# EAGLE design Regulator (EAGLE 7.5.0)
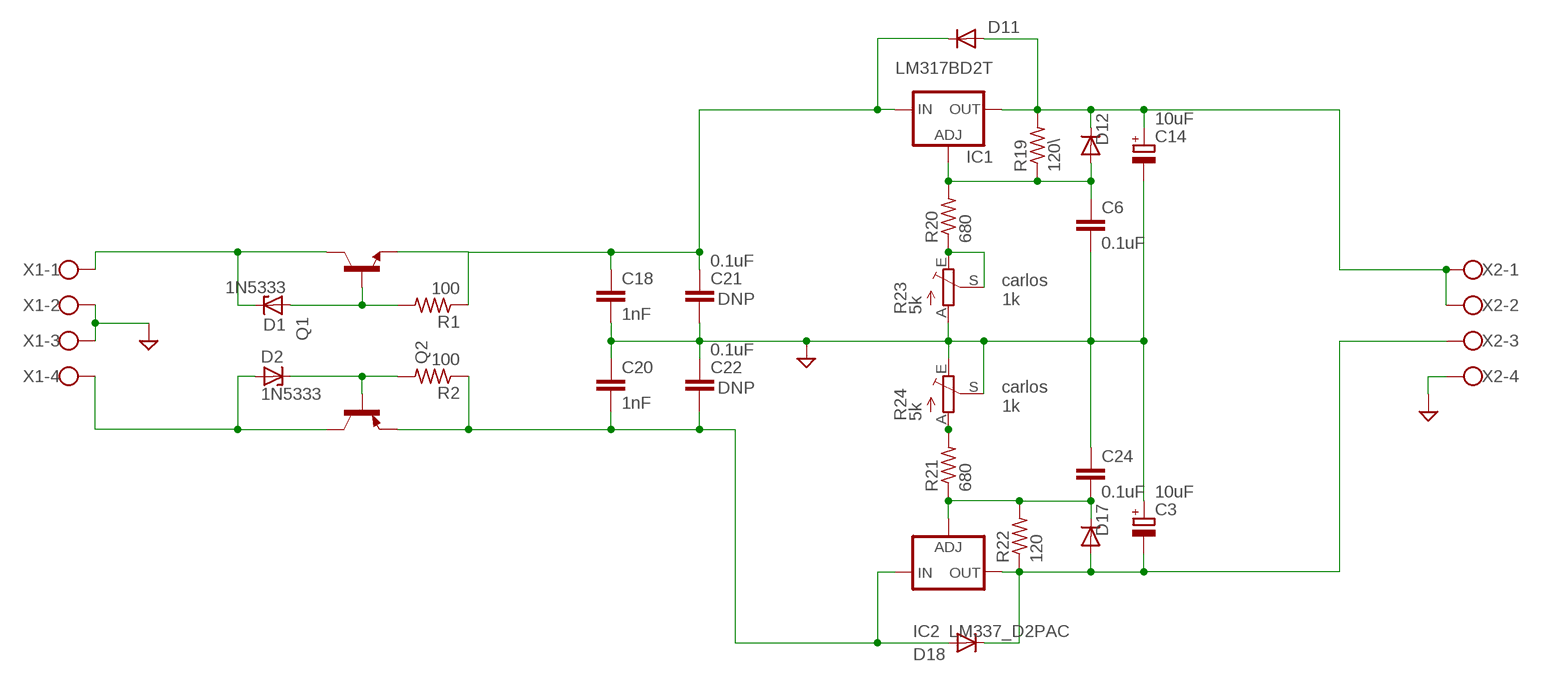
[diagram p0: schematic, sheet 1]

## Parts
C3  10uF  CPOL-EUE2.5-6  [E2,5-6]
C6  0.1uF  C-EU025-025X050  [C025-025X050]
C14  10uF  CPOL-EUE2.5-6  [E2,5-6]
C18  1nF  C-EU025-025X050  [C025-025X050]
C20  1nF  C-EU025-025X050  [C025-025X050]
C21  0.1uF  C-EU025-025X050  [C025-025X050]
C22  0.1uF  C-EU025-025X050  [C025-025X050]
C24  0.1uF  C-EU025-025X050  [C025-025X050]
D1  1N5333  [C1702-15]
D2  1N5333  [C1702-15]
D11  1N4004  [1N4004]
D12  1N4004  [1N4004]
D17  1N4004  [1N4004]
D18  1N4004  [1N4004]
IC1  LM317BD2T  [D2PACK]
IC2  LM337_D2PAC  [D2PACK]
Q1  -NPN-TO220V  [TO220V]
Q2  -PNP-TO220V  [TO220V]
R1  100  R-US_0309/12  [0309/12]
R2  100  R-US_0309/12  [0309/12]
R19  120\  R-US_0309/V  [0309V]
R20  680  R-US_0309/V  [0309V]
R21  680  R-US_0309/V  [0309V]
R22  120  R-US_0309/V  [0309V]
R23  5k  TRIM_EU-B25P  [B25P]
R24  5k  TRIM_EU-B25P  [B25P]
X1  W237-4  [W237-4]
X2  W237-4  [W237-4]

## Nets
GND: C3.+ C6.2 C14.- C18.2 C20.1 C21.2 C22.1 C24.1 R23.A R24.E R24.S X1.2 X1.3 X2.4 ; supply symbol labelled SGND
N$1: D1.A Q1.1(B) R1.2
N$3: C24.2 D17.C IC2.1(ADJ) R21.1 R22.2
N$4: D1.C Q1.2(C) X1.1
N$5: D2.C Q2.1(B) R2.2
N$6: D2.A Q2.2(C) X1.4
N$15: R20.1 R23.E R23.S
N$23: R21.2 R24.A
N$26: C6.1 D12.A IC1.1(ADJ) R19.1 R20.2
V15+: C14.+ D11.A D12.C IC1.2(OUT) R19.2 X2.1 X2.2
V15-: C3.- D17.A D18.C IC2.2(OUT) R22.1 X2.3
V15UN: C18.1 C21.1 D11.C IC1.3(IN) Q1.3(E) R1.1
V-15UN: C20.2 C22.2 D18.A IC2.3(IN) Q2.3(E) R2.1

## Notes on the sheet
- DNP
- carlos 
  1k
- DNP
- carlos 
  1k

## Library data of the parts
C3 C14 = rcl:CPOL-EU: POLARIZED CAPACITOR, European symbol
C6 C24 = resistor:C-EU: CAPACITOR, European symbol
C18 C20-C22 = rcl:C-EU: CAPACITOR, European symbol
D1 D2 = diode:1N5333: Z DIODE 3.3 V, 5W, 5 percent (Motorola)
D11 D12 D17 D18 = Amplifier_Parts:1N4004
IC1 = v-reg:LM317?*: 500 mA Adjustable Output Positive Voltage Regulator Source: http://www.onsemi.co.jp .. LM317M-D.PDF
IC2 = v-reg:LM337_D2PAC
Q1 = transistor:*-NPN-: NPN Transistror BF959 corrected 2008.03.06
Q2 = transistor:*-PNP-: PNP Transistror
R1 R2 R19-R22 = rcl:R-US_: RESISTOR, American symbol
R23 R24 = pot:TRIM_EU-: POTENTIOMETER
X1 X2 = con-wago-500:W237-4: WAGO SCREW CLAMP; OC_FARNELL: unknown; OC_NEWARK: unknown

## Board
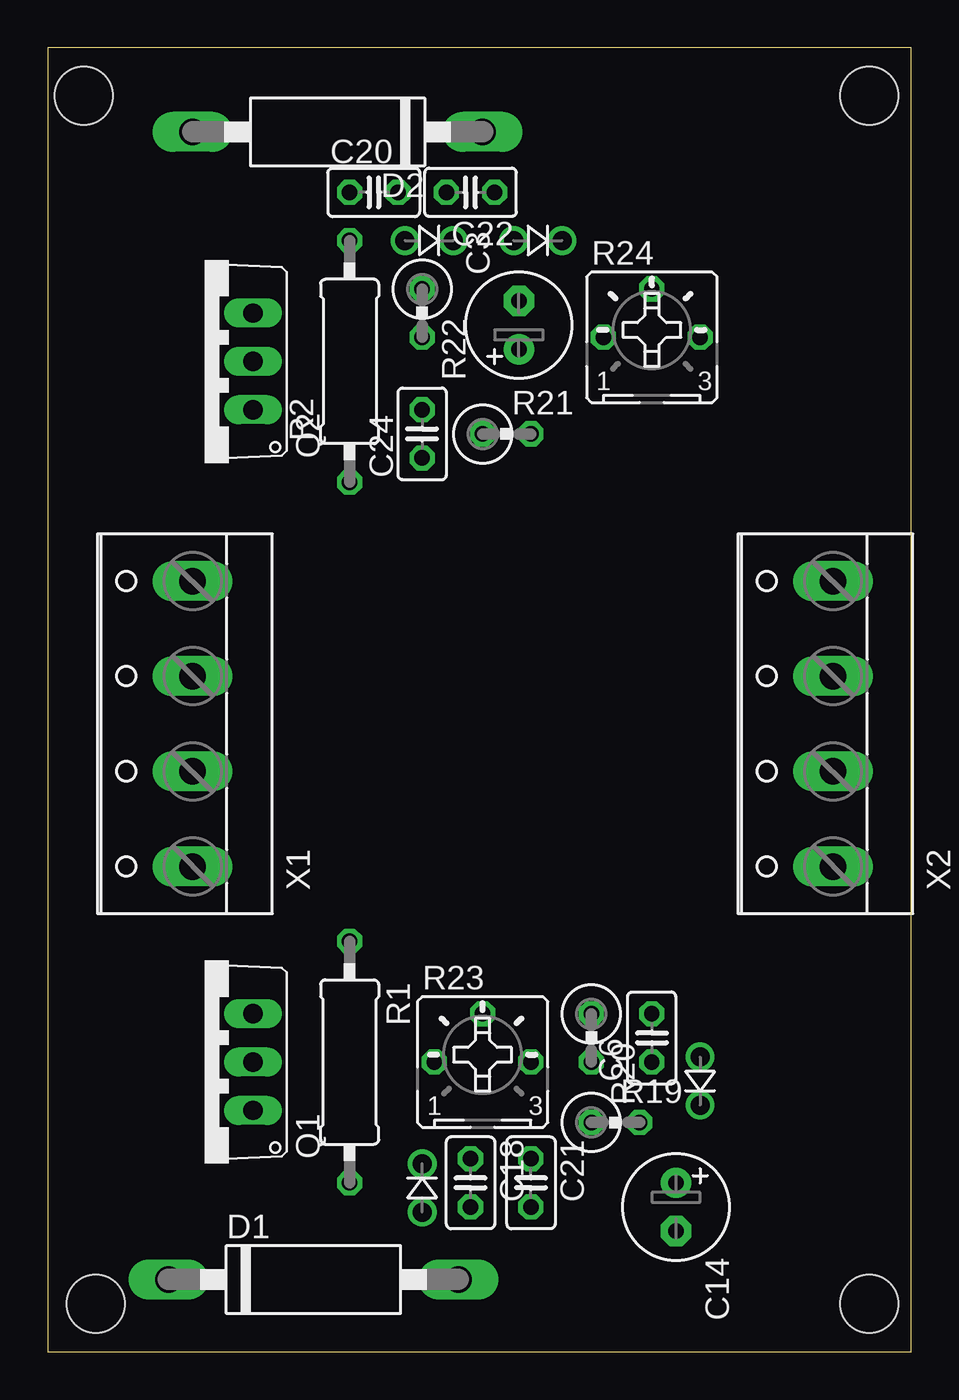
[diagram p1: board, top side]
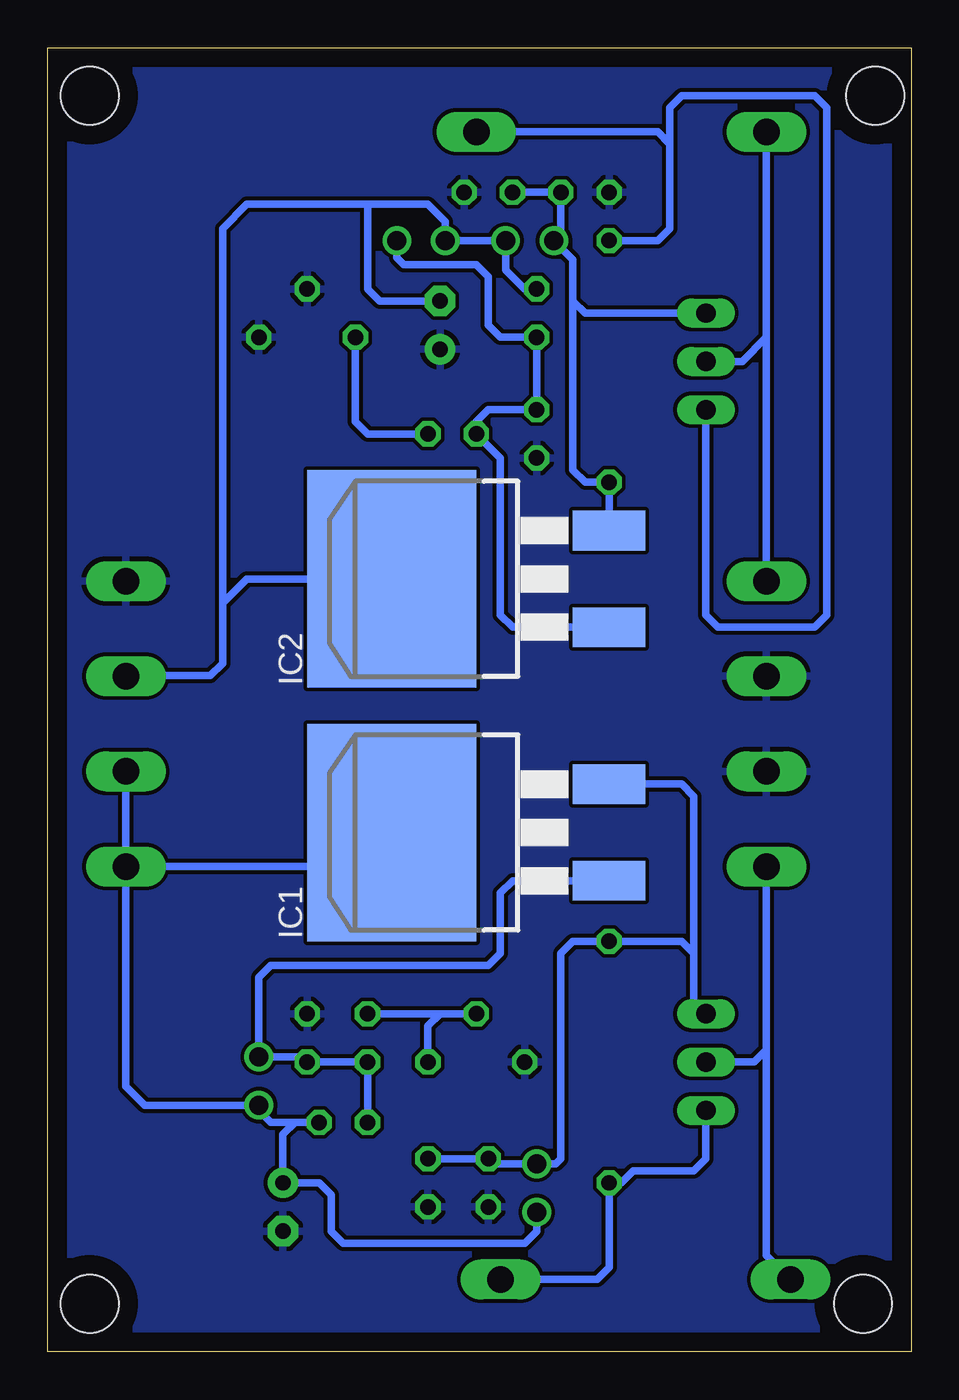
[diagram p2: board, bottom side, seen from below]

Size 45.39 x 68.57 mm. Coordinates in mm from the lower left corner, seen from the top.
Outline: 0,0 45.39,0 45.39,68.57 0,68.57 0,0
Copper layers (1*16): Top 0.035mm / dielectric 1.5mm / Bottom 0.035mm
Design rules "default": minimum track width 10mil, minimum drill 24mil, track to track 8mil, track to pad 8mil, pad to pad 8mil, via to via 8mil, smd to smd 8mil, copper to edge 40mil, drill to drill 8mil, minimum pad ring 10mil, minimum via ring 8mil, stop-mask expansion 4mil, vias tented up to drill 0mil, thermal gap 10mil
Holes 3.05 mm at 2.54,2.54 43.18,2.54 43.18,66.04 1.91,66.04

### Footprints (pad centres in the part's own frame; a part is rotated, then mirrored left to right if it is on the bottom)
E2,5-6 = drill 0.813 pad 1.6: + -1.27,0 | drill 0.813 pad 1.6 octagon: - 1.27,0
C025-025X050 = drill 0.813 octagon: 1 -1.27,0; 2 1.27,0
C1702-15 = drill 1.397 long: A 7.62,0; C -7.62,0
1N4004 = drill 1: A 4.08,0; C 1.54,0
D2PACK = smd 2.083 x 3.81: 1 -2.54,-8.89; 3 2.54,-8.89 | smd 11.43 x 8.89: 2 0,2.54
TO220V = drill 1.016 long: 1 -2.54,-2.54; 2 0,-2.54; 3 2.54,-2.54
0309/12 = drill 0.813 octagon: 1 -6.35,0; 2 6.35,0
0309V = drill 0.813 octagon: 1 -1.27,0; 2 1.27,0
B25P = drill 0.813 octagon: A -2.54,0; E 2.54,0; S 0,2.54
W237-4 = drill 1.397 long: 1 -7.5,-1.27; 2 -2.5,-1.27; 3 2.5,-1.27; 4 7.5,-1.27

### Placement (x,y rotation side)
C3  24.77,53.98 90 top
C6  31.75,16.51 90 top
C14  33.02,7.62 270 top
C18  22.23,8.89 270 top
C20  17.15,60.96 0 top
C21  25.4,8.89 270 top
C22  22.23,60.96 180 top
C24  19.69,48.26 90 top
D1  13.97,3.81 0 top
D2  15.24,64.13 180 top
D11  19.69,11.43 270 top
D12  34.29,11.43 90 top
D17  28.57,58.42 180 top
D18  22.86,58.42 180 top
IC1  24.77,27.3 90 bottom
IC2  24.77,40.64 90 bottom
Q1  8.26,15.24 90 top
Q2  8.26,52.07 90 top
R1  15.88,15.24 270 top
R2  15.88,52.07 90 top
R19  29.84,12.06 0 top
R20  28.57,16.51 270 top
R21  24.13,48.26 0 top
R22  19.69,54.61 270 top
R23  22.86,15.24 0 top
R24  31.75,53.34 0 top
X1  6.35,33.02 90 top
X2  40,33.02 90 top

### Tracks (layer width: path | path; a pad name or v marks a point on that pad's centre or on a via)
GND
  pour Bottom: -6.98,0 96.52,-0.64 96.52,76.83 -6.35,76.83
N$1
  Bottom 0.406: D1.A 16.51,3.81 15.88,4.45 R1.2 15.24,8.89 14.6,9.53 11.43,9.53 10.79,10.16 Q1.1
N$3
  Bottom 0.406: D17.C 27.03,57.52 26.67,57.15 22.86,57.15 22.23,56.52 22.23,53.98 21.59,53.34 R22.2 C24.2 22.23,49.53 22.86,48.9 R21.1 21.59,46.99 21.59,38.73 20.95,38.1 IC2.1
N$4
  Bottom 0.406: X1.1 7.62,15.88 | 7.62,15.88 7.62,5.08 D1.C | Q1.2 8.26,15.24 7.62,15.88
N$5
  Bottom 0.406: D2.C 13.33,64.13 12.7,63.5 | 12.7,63.5 12.7,59.05 13.33,58.42 R2.2 | Q2.1 10.79,38.73 10.16,38.1 5.08,38.1 4.45,38.73 4.45,65.41 5.08,66.04 12.06,66.04 12.7,65.41 12.7,63.5
N$6
  Bottom 0.406: X1.4 7.62,53.34 | 7.62,53.34 D2.A | Q2.2 8.89,52.07 7.62,53.34
N$15
  Bottom 0.406: R23.S 24.77,17.78 | 24.77,17.78 25.4,17.14 R23.E | R20.1 24.77,17.78
N$23
  Bottom 0.406: R21.2 28.57,48.26 29.21,48.9 R24.A
N$26
  Bottom 0.406: R19.1 R20.2 C6.1 32.02,15.51 D12.A 34.29,19.68 33.66,20.32 22.23,20.32 21.59,20.95 21.59,24.13 20.95,24.76 IC1.1
V15+
  Bottom 0.406: 32.38,12.06 33.02,11.43 C14.+ 31.12,8.89 30.48,8.26 30.48,6.35 29.84,5.71 20.32,5.71 19.69,6.35 D11.A | 32.38,12.06 R19.2 | 32.38,12.06 33.66,12.06 34.29,12.7 D12.C 40.27,12.97 41.27,13.97 X2.1 | X2.1 X2.2 | X2.1 29.09,25.52 IC1.2
V15-
  Bottom 0.406: 28.57,60.33 25.4,60.33 24.49,59.42 D17.A D18.C 21.32,56.88 20.32,55.88 R22.1 | 28.57,60.33 34.92,60.33 36.2,59.05 36.2,39.37 | 36.2,39.37 34.92,40.64 IC2.2 | C3.- 27.94,55.25 28.57,55.88 28.57,60.33 | 36.2,39.37 36.2,36.2 36.83,35.56 41.23,35.56 X2.3
V15UN
  Bottom 0.406: IC1.3 12.06,29.84 11.43,29.21 11.43,20.95 | 11.43,20.95 11.43,17.78 Q1.3 | C21.1 C18.1 21.95,9.89 D11.C 18.69,9.89 18.41,10.16 18.41,20.95 17.78,21.59 R1.1 12.06,21.59 11.43,20.95
V-15UN
  Bottom 0.406: IC2.3 R2.1 17.15,45.72 17.78,46.36 17.78,55.25 | C22.2 C20.2 18.41,58.79 D18.A 17.78,57.42 17.78,55.25 | Q2.3 17.15,54.61 17.78,55.25